# Altium project M_G_T.PrjPcb
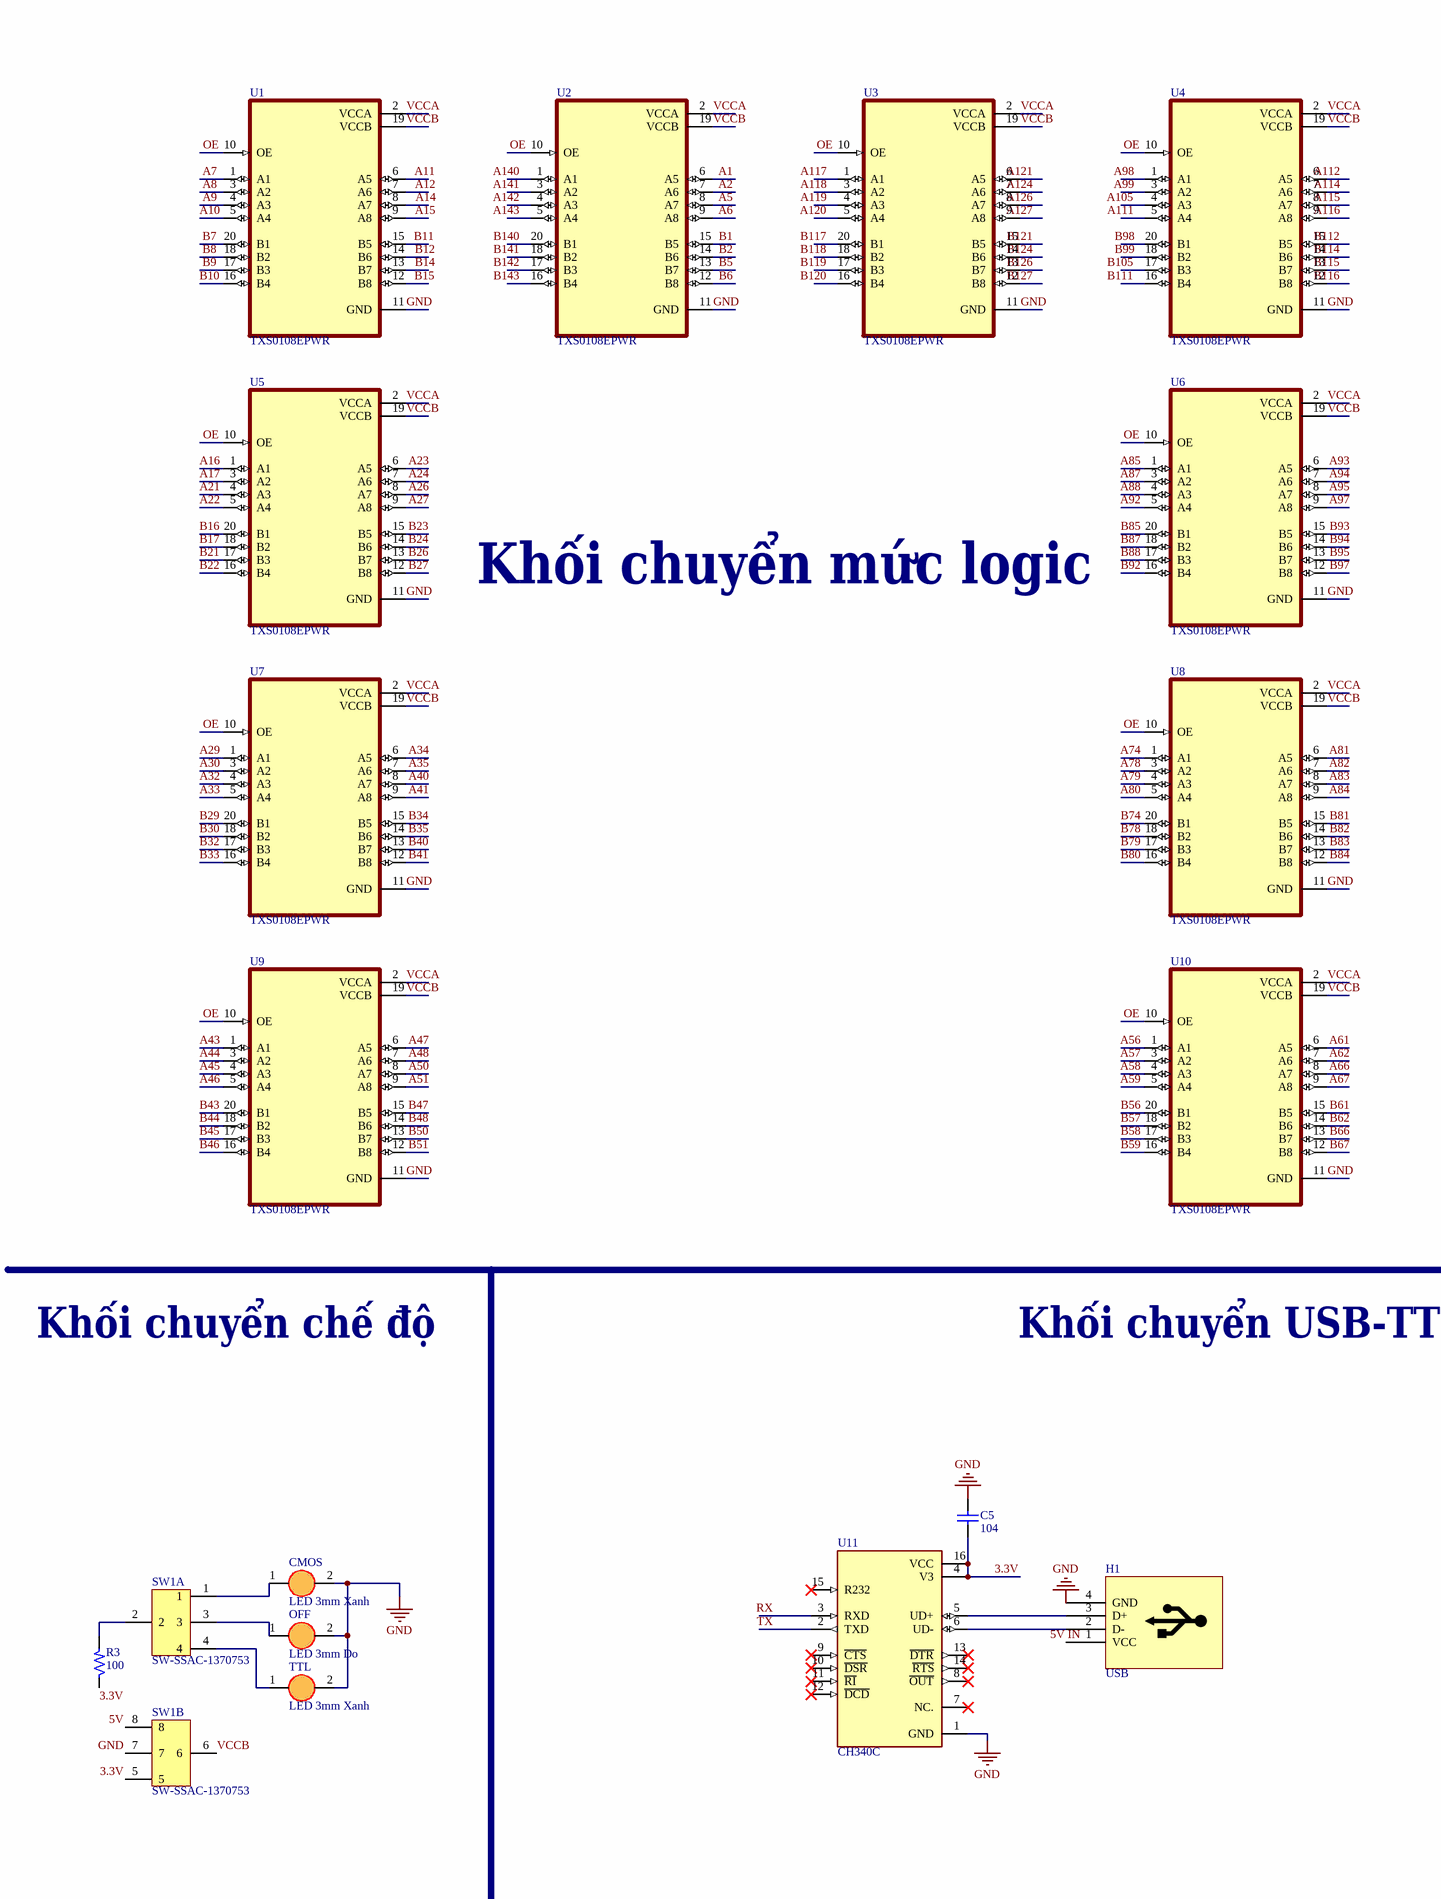
[diagram p0: SCH_Mach_giao_tiep.SchDoc, left]
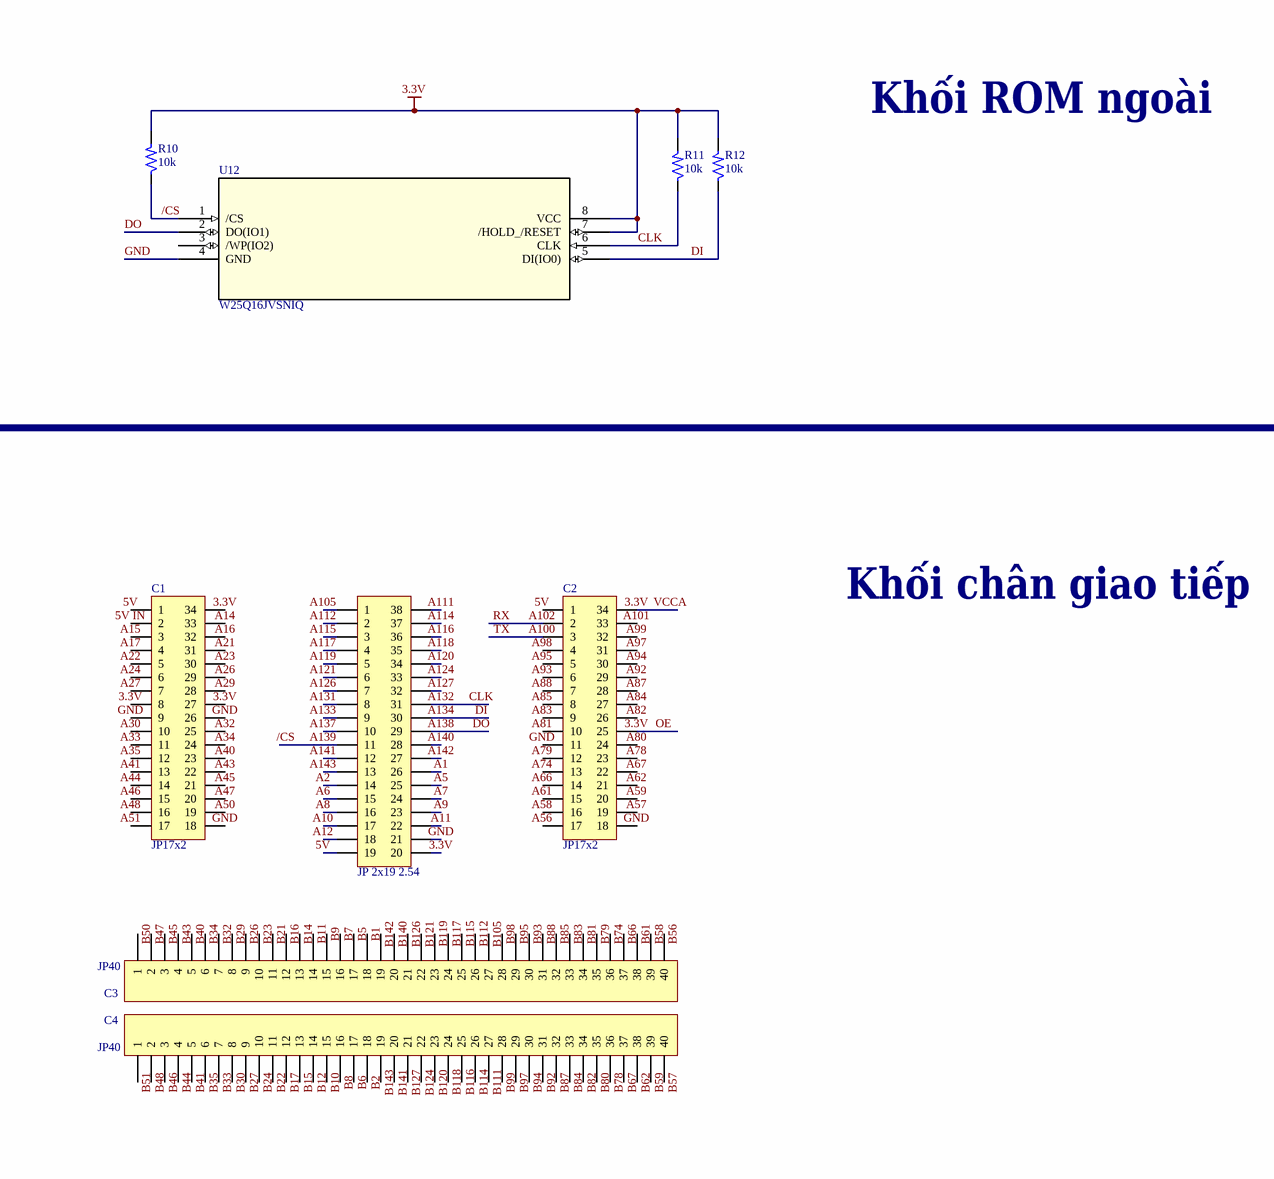
[diagram p1: SCH_Mach_giao_tiep.SchDoc, right]
1 sheet, 27 parts. Net scope: global (net labels, ports and power ports of the same name join across sheets).
Board file: PCB_Mach_giao_tiep.PcbDoc

## Sheet SCH_Mach_giao_tiep.SchDoc: MẠCH GIOA TIẾP
size A2; SheetNumber: 1; SheetTotal: 1

### Parts
C1  JP17x2  [JP17-C2T]
C2  JP17x2  [JP17-C2T]
C3  JP40  [JP40-D1T]
C4  JP40  [JP40-D1T]
C5  104  [tu gom]
CMOS  LED 3mm Xanh  [LED 3MM XANH]
H1  USB  [USB-B-STRANGE]
JP1  JP 2x19 2.54  [JP 2x20 CT]
OFF  LED 3mm Do  [LED 3mm Do]
R3  100  [DIEN TRO 1/4 W]
R10  10k  [SM-0805]
R11  10k  [SM-0805]
R12  10k  [SM-0805]
SW1  SW-SSAC-1370753  [SW-SSAC-1370753]  (parts A,B of 2)
TTL  LED 3mm Xanh  [LED 3MM XANH]
U1  TXS0108EPWR  [SOP65P640X120-20N]
U2  TXS0108EPWR  [SOP65P640X120-20N]
U3  TXS0108EPWR  [SOP65P640X120-20N]
U4  TXS0108EPWR  [SOP65P640X120-20N]
U5  TXS0108EPWR  [SOP65P640X120-20N]
U6  TXS0108EPWR  [SOP65P640X120-20N]
U7  TXS0108EPWR  [SOP65P640X120-20N]
U8  TXS0108EPWR  [SOP65P640X120-20N]
U9  TXS0108EPWR  [SOP65P640X120-20N]
U10  TXS0108EPWR  [SOP65P640X120-20N]
U11  CH340C  [SOIC127P600X180-16N]
U12  W25Q16JVSNIQ  [WIN_SS-8_WIN-M]

### Nets
3.3V: C1.8 C1.27 C1.34 C2.25 C2.34 C5.1 JP1.20 R3.1 R10.2 R11.2 R12.2 SW1.5 U1.2(VCCA) U1.10(OE) U2.2(VCCA) U2.10(OE) U3.2(VCCA) U3.10(OE) U4.2(VCCA) U4.10(OE) U5.2(VCCA) U5.10(OE) U6.2(VCCA) U6.10(OE) U7.2(VCCA) U7.10(OE) U8.2(VCCA) U8.10(OE) U9.2(VCCA) U9.10(OE) U10.2(VCCA) U10.10(OE) U11.4(V3) U11.16(VCC) U12.7(/HOLD_/RESET) U12.8(VCC)  [also labelled OE, VCCA]
GND: C1.9 C1.18 C1.26 C2.11 C2.18 C5.2 CMOS.2(K) H1.4(GND) JP1.21 OFF.2(K) SW1.7 TTL.2(K) U1.11(GND) U2.11(GND) U3.11(GND) U4.11(GND) U5.11(GND) U6.11(GND) U7.11(GND) U8.11(GND) U9.11(GND) U10.11(GND) U11.1(GND) U12.4(GND)
5V: C1.1 C2.1 JP1.19 SW1.8
5V IN: C1.2 H1.1(VCC)
/CS: JP1.11 R10.1 U12.1(/CS)  [also labelled A139]
A1: JP1.26 U2.6(A5)
A2: JP1.14 U2.7(A6)
A5: JP1.25 U2.8(A7)
A6: JP1.15 U2.9(A8)
A7: JP1.24 U1.1(A1)
A8: JP1.16 U1.3(A2)
A9: JP1.23 U1.4(A3)
A10: JP1.17 U1.5(A4)
A11: JP1.22 U1.6(A5)
A12: JP1.18 U1.7(A6)
A14: C1.33 U1.8(A7)
A15: C1.3 U1.9(A8)
A16: C1.32 U5.1(A1)
A17: C1.4 U5.3(A2)
A21: C1.31 U5.4(A3)
A22: C1.5 U5.5(A4)
A23: C1.30 U5.6(A5)
A24: C1.6 U5.7(A6)
A26: C1.29 U5.8(A7)
A27: C1.7 U5.9(A8)
A29: C1.28 U7.1(A1)
A30: C1.10 U7.3(A2)
A32: C1.25 U7.4(A3)
A33: C1.11 U7.5(A4)
A34: C1.24 U7.6(A5)
A35: C1.12 U7.7(A6)
A40: C1.23 U7.8(A7)
A41: C1.13 U7.9(A8)
A43: C1.22 U9.1(A1)
A44: C1.14 U9.3(A2)
A45: C1.21 U9.4(A3)
A46: C1.15 U9.5(A4)
A47: C1.20 U9.6(A5)
A48: C1.16 U9.7(A6)
A50: C1.19 U9.8(A7)
A51: C1.17 U9.9(A8)
A56: C2.17 U10.1(A1)
A57: C2.19 U10.3(A2)
A58: C2.16 U10.4(A3)
A59: C2.20 U10.5(A4)
A61: C2.15 U10.6(A5)
A62: C2.21 U10.7(A6)
A66: C2.14 U10.8(A7)
A67: C2.22 U10.9(A8)
A74: C2.13 U8.1(A1)
A78: C2.23 U8.3(A2)
A79: C2.12 U8.4(A3)
A80: C2.24 U8.5(A4)
A81: C2.10 U8.6(A5)
A82: C2.26 U8.7(A6)
A83: C2.9 U8.8(A7)
A84: C2.27 U8.9(A8)
A85: C2.8 U6.1(A1)
A87: C2.28 U6.3(A2)
A88: C2.7 U6.4(A3)
A92: C2.29 U6.5(A4)
A93: C2.6 U6.6(A5)
A94: C2.30 U6.7(A6)
A95: C2.5 U6.8(A7)
A97: C2.31 U6.9(A8)
A98: C2.4 U4.1(A1)
A99: C2.32 U4.3(A2)
A100: C2.3 U11.2(TXD)  [also labelled TX]
A101: C2.33
A102: C2.2 U11.3(RXD)  [also labelled RX]
A105: JP1.1 U4.4(A3)
A111: JP1.38 U4.5(A4)
A112: JP1.2 U4.6(A5)
A114: JP1.37 U4.7(A6)
A115: JP1.3 U4.8(A7)
A116: JP1.36 U4.9(A8)
A117: JP1.4 U3.1(A1)
A118: JP1.35 U3.3(A2)
A119: JP1.5 U3.4(A3)
A120: JP1.34 U3.5(A4)
A121: JP1.6 U3.6(A5)
A124: JP1.33 U3.7(A6)
A126: JP1.7 U3.8(A7)
A127: JP1.32 U3.9(A8)
A131: JP1.8
A132: JP1.31 R11.1 U12.6(CLK)  [also labelled CLK]
A133: JP1.9
A134: JP1.30 R12.1 U12.5(DI(IO0))  [also labelled DI]
A137: JP1.10
A138: JP1.29 U12.2(DO(IO1))  [also labelled DO]
A140: JP1.28 U2.1(A1)
A141: JP1.12 U2.3(A2)
A142: JP1.27 U2.4(A3)
A143: JP1.13 U2.5(A4)
B1: C3.18 U2.15(B5)
B2: C4.18 U2.14(B6)
B5: C3.17 U2.13(B7)
B6: C4.17 U2.12(B8)
B7: C3.16 U1.20(B1)
B8: C4.16 U1.18(B2)
B9: C3.15 U1.17(B3)
B10: C4.15 U1.16(B4)
B11: C3.14 U1.15(B5)
B12: C4.14 U1.14(B6)
B14: C3.13 U1.13(B7)
B15: C4.13 U1.12(B8)
B16: C3.12 U5.20(B1)
B17: C4.12 U5.18(B2)
B21: C3.11 U5.17(B3)
B22: C4.11 U5.16(B4)
B23: C3.10 U5.15(B5)
B24: C4.10 U5.14(B6)
B26: C3.9 U5.13(B7)
B27: C4.9 U5.12(B8)
B29: C3.8 U7.20(B1)
B30: C4.8 U7.18(B2)
B32: C3.7 U7.17(B3)
B33: C4.7 U7.16(B4)
B34: C3.6 U7.15(B5)
B35: C4.6 U7.14(B6)
B40: C3.5 U7.13(B7)
B41: C4.5 U7.12(B8)
B43: C3.4 U9.20(B1)
B44: C4.4 U9.18(B2)
B45: C3.3 U9.17(B3)
B46: C4.3 U9.16(B4)
B47: C3.2 U9.15(B5)
B48: C4.2 U9.14(B6)
B50: C3.1 U9.13(B7)
B51: C4.1 U9.12(B8)
B56: C3.40 U10.20(B1)
B57: C4.40 U10.18(B2)
B58: C3.39 U10.17(B3)
B59: C4.39 U10.16(B4)
B61: C3.38 U10.15(B5)
B62: C4.38 U10.14(B6)
B66: C3.37 U10.13(B7)
B67: C4.37 U10.12(B8)
B74: C3.36 U8.20(B1)
B78: C4.36 U8.18(B2)
B79: C3.35 U8.17(B3)
B80: C4.35 U8.16(B4)
B81: C3.34 U8.15(B5)
B82: C4.34 U8.14(B6)
B83: C3.33 U8.13(B7)
B84: C4.33 U8.12(B8)
B85: C3.32 U6.20(B1)
B87: C4.32 U6.18(B2)
B88: C3.31 U6.17(B3)
B92: C4.31 U6.16(B4)
B93: C3.30 U6.15(B5)
B94: C4.30 U6.14(B6)
B95: C3.29 U6.13(B7)
B97: C4.29 U6.12(B8)
B98: C3.28 U4.20(B1)
B99: C4.28 U4.18(B2)
B105: C3.27 U4.17(B3)
B111: C4.27 U4.16(B4)
B112: C3.26 U4.15(B5)
B114: C4.26 U4.14(B6)
B115: C3.25 U4.13(B7)
B116: C4.25 U4.12(B8)
B117: C3.24 U3.20(B1)
B118: C4.24 U3.18(B2)
B119: C3.23 U3.17(B3)
B120: C4.23 U3.16(B4)
B121: C3.22 U3.15(B5)
B124: C4.22 U3.14(B6)
B126: C3.21 U3.13(B7)
B127: C4.21 U3.12(B8)
B140: C3.20 U2.20(B1)
B141: C4.20 U2.18(B2)
B142: C3.19 U2.17(B3)
B143: C4.19 U2.16(B4)
VCCB: SW1.6 U1.19(VCCB) U2.19(VCCB) U3.19(VCCB) U4.19(VCCB) U5.19(VCCB) U6.19(VCCB) U7.19(VCCB) U8.19(VCCB) U9.19(VCCB) U10.19(VCCB)
NetCMOS_1: CMOS.1(A) SW1.1
NetH1_2: H1.2(D-) U11.6(UD-)
NetH1_3: H1.3(D+) U11.5(UD+)
NetOFF_1: OFF.1(A) SW1.3
NetR3_2: R3.2 SW1.2
NetSW1_4: SW1.4 TTL.1(A)

Not connected (* = marked no-connect by the designer): H1 5 6; U11 7(NC.)* 8(~{OUT})* 9(~{CTS})* 10(~{DSR})* 11(~{RI})* 12(~{DCD})* 13(~{DTR})* 14(~{RTS})* 15(R232)*; U12 3(/WP(IO2))

### Notes on the sheet
- Khối ROM ngoài
- Khối chuyển mức logic
- Khối chân giao tiếp
- Khối chuyển chế độ
- Khối chuyển USB-TTL
- Title
- Size:
- Date:
- Author:
- A4
- Time:
- Number:
- Checked:
- Revision:
- Sheet
- Approved:
- of
- File:

### Library data of the parts
C1 C2 = JP17x2: WR-PHD 2.54 mm Dual Socket Header; Manufacturer: W¨¹rth Elektronik eiSos GmbH; partNo: 61303421821; ComponentLink1 Description: Manufacturer; ComponentLink2 Description: Datasheet; NoPins: 34; Created Date: 29 March 2013; ComponentLink1URL: http://www.we-online.com; ComponentLink2URL: http://katalog.we-online.de/em/datasheet/6130xx21821.pdf; Created by: Karrer Zheng
C3 C4 = JP40: WR-PHD 2.54 mm Angled Socket Header; Manufacturer: W¨¹rth Elektronik eiSos GmbH; partNo: 613040143121; ComponentLink1 Description: Manufacturer; ComponentLink2 Description: Datasheet; NoPins: 40; Created Date: 29 March 2013; ComponentLink1URL: http://www.we-online.com; ComponentLink2URL: http://katalog.we-online.de/em/datasheet/6130xx143121.pdf; Created by: Karrer Zheng
C5 = Tu gom 104 50V: Cắm; So_Chan: 2; Ten_Linh_Kien: Tụ gốm 104 100nF 50V; Don_Vi: Con; Ma_Hang: MH004761; Chung_Loai: Cắm; Kieu_Chan: *
CMOS TTL = LED 3mm Xanh: Cắm; Ten_Linh_Kien: LED 3MM Xanh Lá ( SS); Ma_Hang: MH004935; Don_Vi: Con; Ghi_Chu: *; Kieu_Chan: *; Chung_Loai: Cắm
H1 = USB: USB conector
JP1 = JP 2x19 2.54 Cai Thang: Cắm; Ten_Linh_Kien: Jump Đôi Cái 2.54MM 2x20P Thẳng; Don_Vi: Con; Ma_Hang: MH008647; Ghi_Chu: *; Kieu_Chan: *; Chung_Loai: Cắm
OFF = LED 3mm Do: Cắm; Ten_Linh_Kien: LED 3MM Sáng Đỏ ( SS); Ma_Hang: MH004931; Don_Vi: Con; Ghi_Chu: *; Kieu_Chan: *; Chung_Loai: Cắm
R3 R10-R12 = Res: Resistor 1/4W; Value: R1/4W - 1K
U11 = CH340C: USB to serial chip CH340; MF: {'manufacturer': u'WCH'}; Price: None; Package: None; Availability: Unavailable; MP: CH340C; Value: *
U12 = W25Q16JVSNIQ: No Description Available; Mfr_Name: Winbond; Copyright: Copyright (C) 2022 Ultra Librarian. All rights reserved.; Manufacturer_Part_Number: W25Q16JVSNIQ; RefDes: RefDes; Type: DEV
U1-U10 = TXS0108EPWR: Price: None; Package: None; Availability: Unavailable; MP: TXS0108EPWR; Value: *